# Altium schematic sheet Power.SchDoc
size A
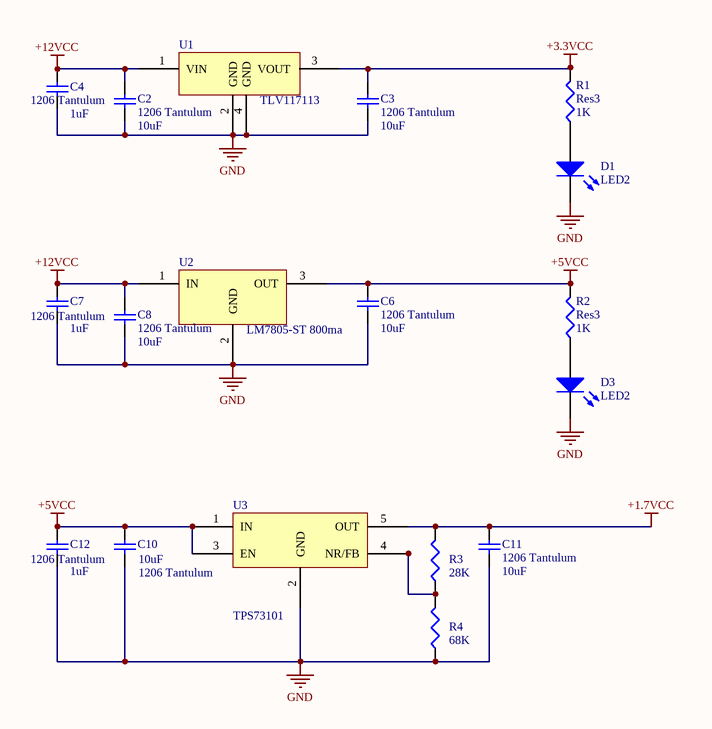
[diagram p0: Power.SchDoc]

## Parts
C2  1206 Tantulum  value 10uF  [C1206]
C3  1206 Tantulum  value 10uF  [C1206]
C4  1206 Tantulum  value 1uF  [C1206]
C6  1206 Tantulum  value 10uF  [C1206]
C7  1206 Tantulum  value 1uF  [C1206]
C8  1206 Tantulum  value 10uF  [C1206]
C10  1206 Tantulum  value 10uF  [C1206]
C11  1206 Tantulum  value 10uF  [C1206]
C12  1206 Tantulum  value 1uF  [C1206]
D1  LED2  [SM 0805 polarized]
D3  LED2  [SM 0805 polarized]
R1  Res3  value 1K  [SM 0805 - gap trimmed]
R2  Res3  value 1K  [SM 0805 - gap trimmed]
R3  value 28K  [SM 0805 - gap trimmed]  (hidden comment: Res3)
R4  value 68K  [SM 0805 - gap trimmed]  (hidden comment: Res3)
U1  TLV117113  [TLV117112]
U2  LM7805-ST 800ma  [DPAK-3]
U3  TPS73101  [TPS73101]

## Nets
+1.7VCC: C11.2 R3.2 U3.5(OUT)
+3.3VCC: C3.2 R1.2 U1.3(VOUT)
+5VCC: C6.2 C10.2 C12.2 R2.2 U2.3(OUT) U3.1(IN) U3.3(EN)
+12VCC: C2.2 C4.2 C7.2 C8.2 U1.1(VIN) U2.1(IN)
GND: C2.1 C3.1 C4.1 C6.1 C7.1 C8.1 C10.1 C11.1 C12.1 D1.1(A) D3.1(A) R4.1 U1.2(GND) U1.4(GND) U2.2(GND) U3.2(GND)
NetD1_2: D1.2(K) R1.1
NetD3_2: D3.2(K) R2.1
NetR3_1: R3.1 R4.2 U3.4(NR/FB)

## Library data of the parts
C2-C4 C6-C8 C10-C12 = Cap Semi: Capacitor (Semiconductor SIM Model); Published: 8-Jun-2000; LatestRevisionDate: 29-May-2009; LatestRevisionNote: IPC-7351 Footprint Added.; PackageReference: C1206; Publisher: Altium Limited; PackageDescription: Chip Capacitor
D1 D3 = LED2: Typical RED, GREEN, YELLOW, AMBER GaAs LED; Published: 8-Jun-2000; LatestRevisionDate: 17-Jul-2002; LatestRevisionNote: Re-released for DXP Platform.; PackageVersion: Feb-2002; PackageReference: 3.2X1.6X1.1; Publisher: Altium Limited; PackageDescription: SM LED; 2 Flat Leads
R1-R4 = Res3: Resistor; Published: 8-Jun-2000; LatestRevisionDate: 29-May-2009; LatestRevisionNote: IPC-7351 Footprint Added.; PackageReference: J1-0603; Publisher: Altium Limited; PackageDescription: Chip Resistor
U1 = TLV117112: Linear Regulator
U2 = LM708-ST 800ma
U3 = TPS73101: Ti TPS73101 Adjustable LDO